# Altium schematic sheet StairLed.SchDoc
size D
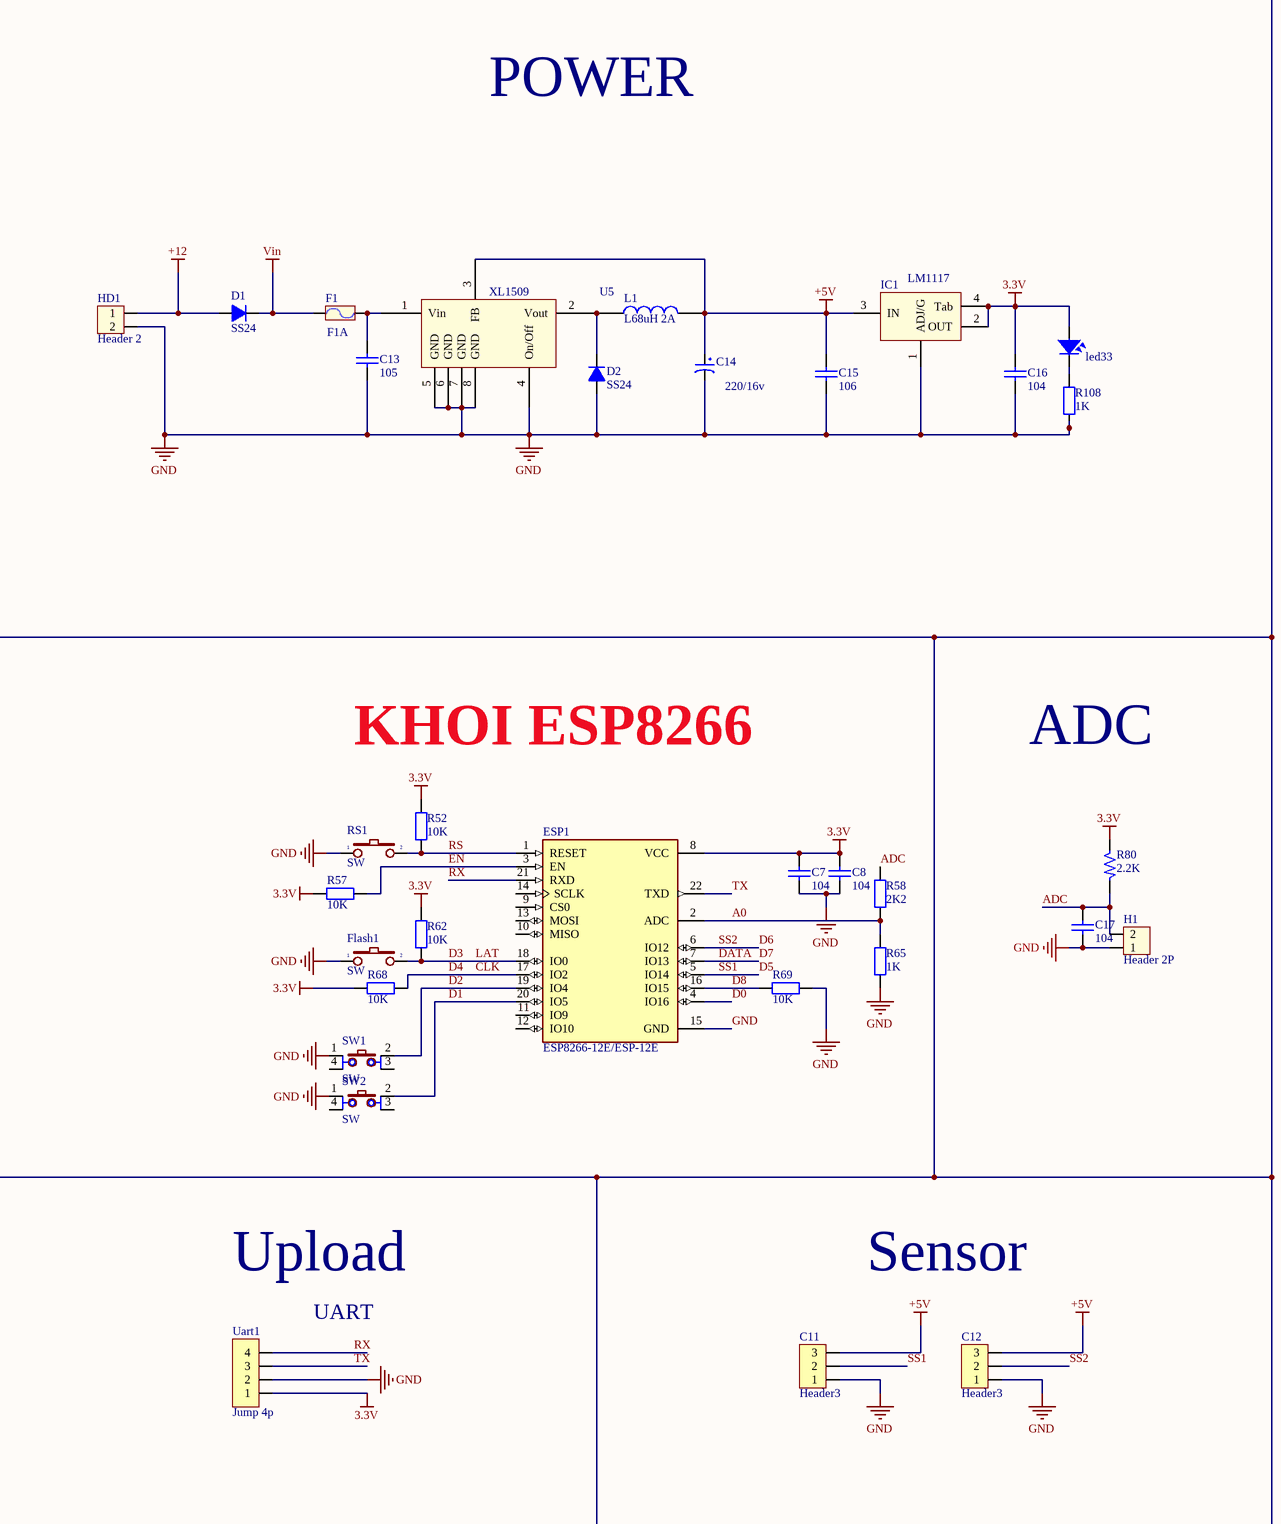
[diagram p0: StairLed.SchDoc, left]
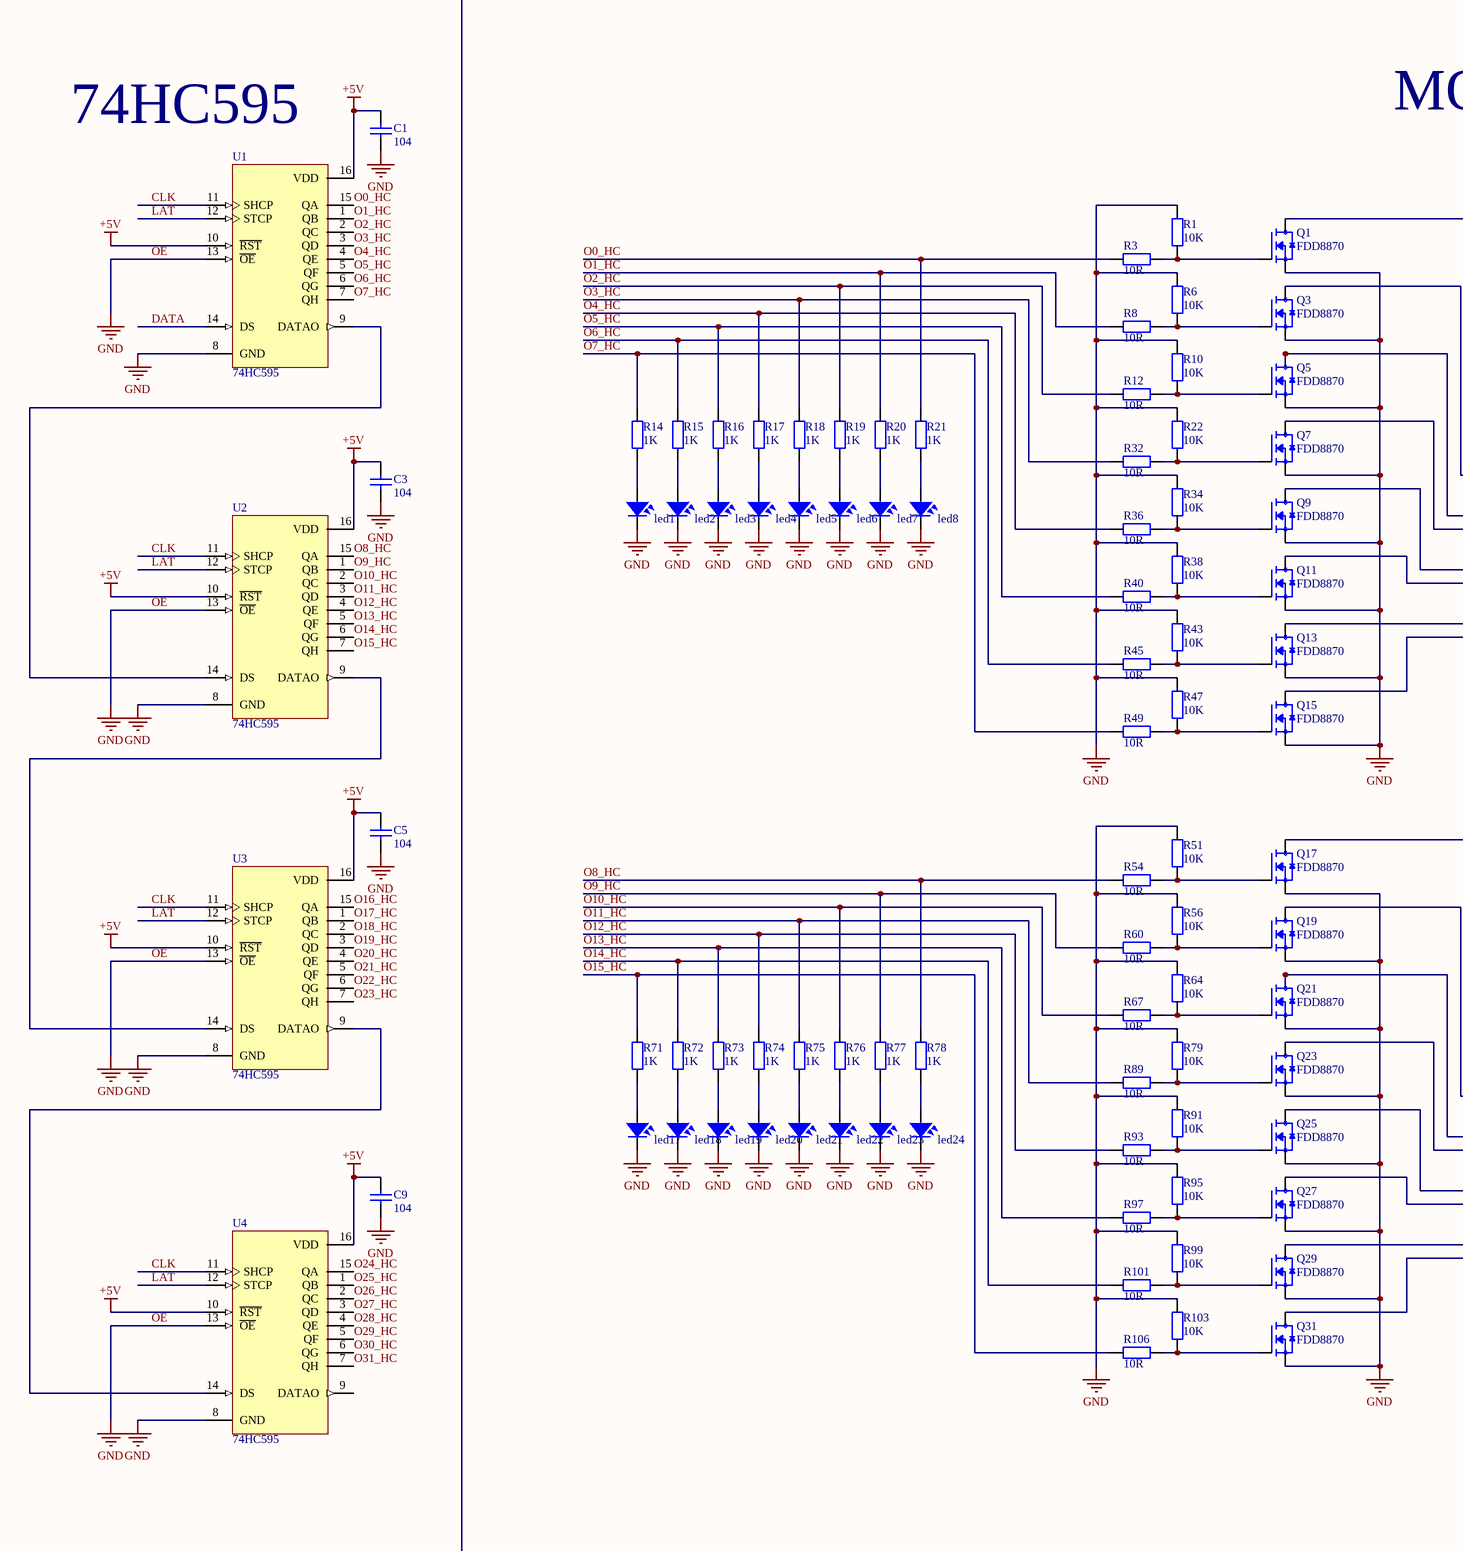
[diagram p1: StairLed.SchDoc, middle]
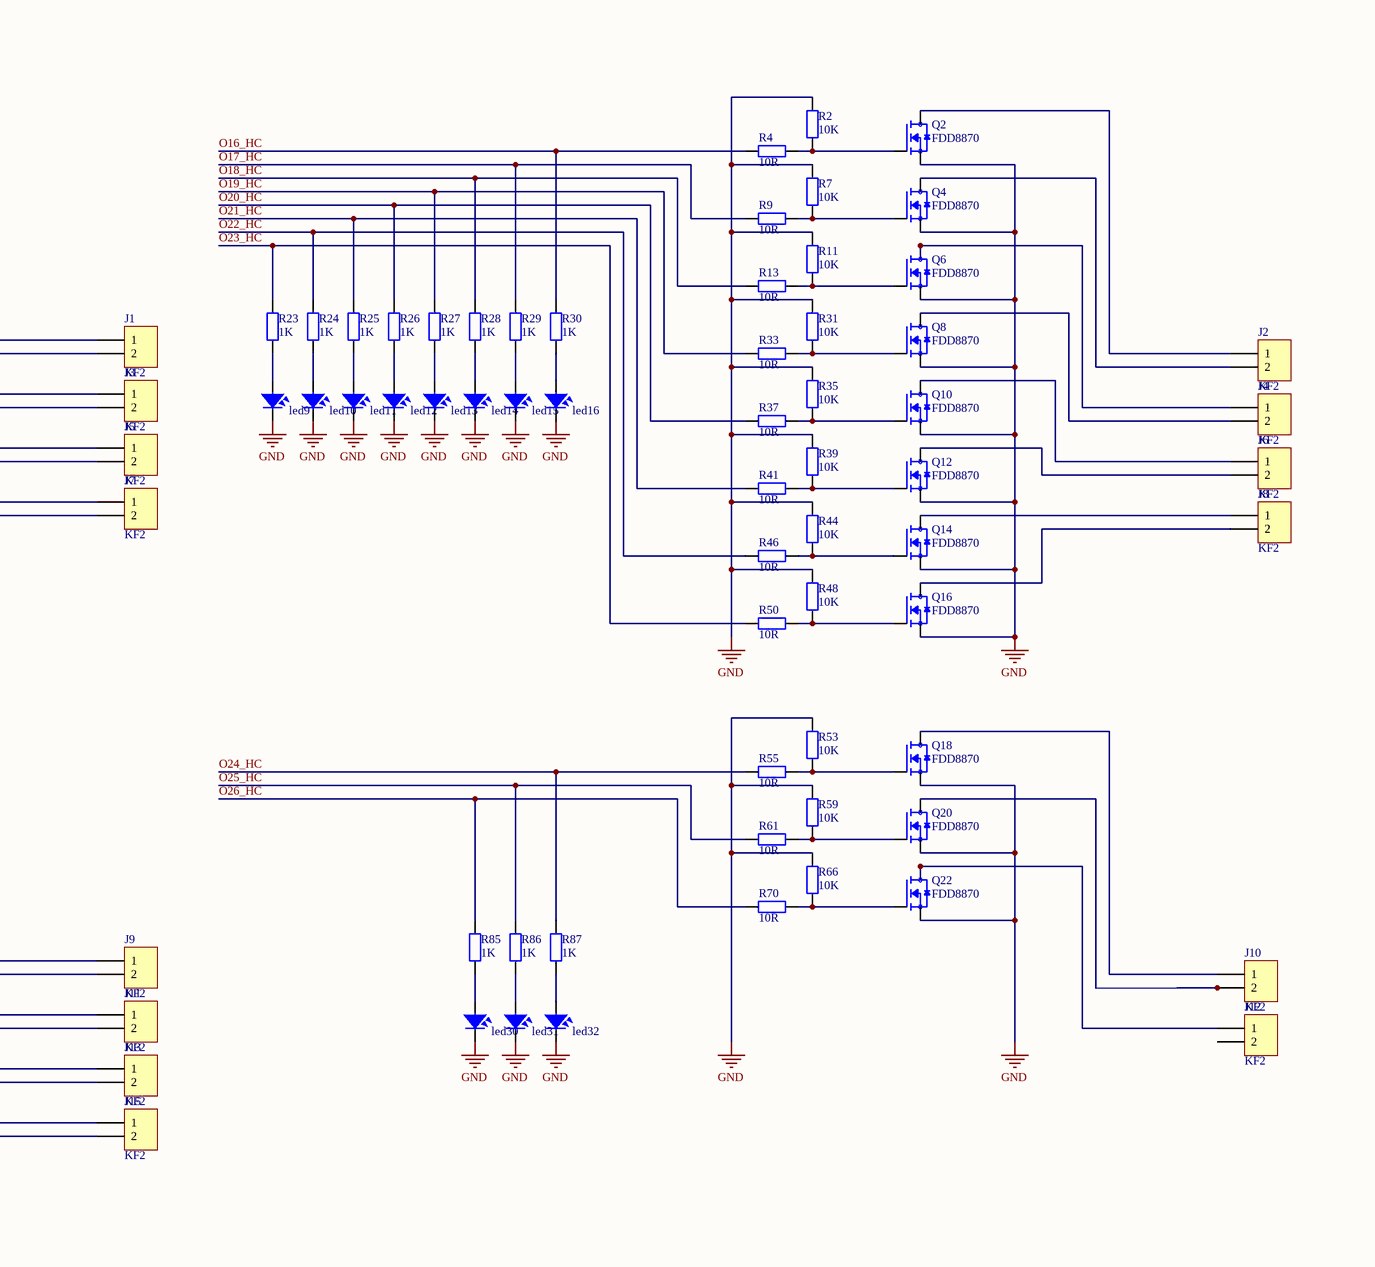
[diagram p2: StairLed.SchDoc, right]

## Parts
C1  104  [Cap-0805]
C3  104  [Cap-0805]
C5  104  [Cap-0805]
C7  104  [Cap-0805]
C8  104  [Cap-0805]
C9  104  [Cap-0805]
C11  Header3  [Header3]
C12  Header3  [Header3]
C13  105  [Cap-0805]
C14  220/16v  [CAP-ALU-SMD-6.3x7.7x2.2]
C15  106  [Cap-0805]
C16  104  [Cap-0805]
C17  104  [Cap-0805]
D1  SS24  [DO-214AC-Zenner]
D2  SS24  [DO-214AC-Zenner]
ESP1  ESP8266-12E/ESP-12E  [XCVR_ESP8266-12E/ESP-12E]
F1  F1A  [1812]
Flash1  SW  [SW1-SMD]
H1  Header 2P  [Header 2P-T]
HD1  Header 2  [HED2]
IC1  LM1117  [SOT223-4N]
J1  KF2  [KF2-3.5]
J2  KF2  [KF2-3.5]
J3  KF2  [KF2-3.5]
J4  KF2  [KF2-3.5]
J5  KF2  [KF2-3.5]
J6  KF2  [KF2-3.5]
J7  KF2  [KF2-3.5]
J8  KF2  [KF2-3.5]
J9  KF2  [KF2-3.5]
J10  KF2  [KF2-3.5]
J11  KF2  [KF2-3.5]
J12  KF2  [KF2-3.5]
J13  KF2  [KF2-3.5]
J15  KF2  [KF2-3.5]
L1  L68uH 2A  [5D28]
led1  LED SMD  [SM-LED-0805-Blue]  (value not drawn)
led2  LED SMD  [SM-LED-0805-Blue]  (value not drawn)
led3  LED SMD  [SM-LED-0805-Blue]  (value not drawn)
led4  LED SMD  [SM-LED-0805-Blue]  (value not drawn)
led5  LED SMD  [SM-LED-0805-Blue]  (value not drawn)
led6  LED SMD  [SM-LED-0805-Blue]  (value not drawn)
led7  LED SMD  [SM-LED-0805-Blue]  (value not drawn)
led8  LED SMD  [SM-LED-0805-Blue]  (value not drawn)
led9  LED SMD  [SM-LED-0805-Blue]  (value not drawn)
led10  LED SMD  [SM-LED-0805-Blue]  (value not drawn)
led11  LED SMD  [SM-LED-0805-Blue]  (value not drawn)
led12  LED SMD  [SM-LED-0805-Blue]  (value not drawn)
led13  LED SMD  [SM-LED-0805-Blue]  (value not drawn)
led14  LED SMD  [SM-LED-0805-Blue]  (value not drawn)
led15  LED SMD  [SM-LED-0805-Blue]  (value not drawn)
led16  LED SMD  [SM-LED-0805-Blue]  (value not drawn)
led17  LED SMD  [SM-LED-0805-Blue]  (value not drawn)
led18  LED SMD  [SM-LED-0805-Blue]  (value not drawn)
led19  LED SMD  [SM-LED-0805-Blue]  (value not drawn)
led20  LED SMD  [SM-LED-0805-Blue]  (value not drawn)
led21  LED SMD  [SM-LED-0805-Blue]  (value not drawn)
led22  LED SMD  [SM-LED-0805-Blue]  (value not drawn)
led23  LED SMD  [SM-LED-0805-Blue]  (value not drawn)
led24  LED SMD  [SM-LED-0805-Blue]  (value not drawn)
led30  LED SMD  [SM-LED-0805-Blue]  (value not drawn)
led31  LED SMD  [SM-LED-0805-Blue]  (value not drawn)
led32  LED SMD  [SM-LED-0805-Blue]  (value not drawn)
led33  LED SMD  [SM-LED-0805-Blue]  (value not drawn)
Q1  FDD8870  [TRANS_SQD50N03-06P-GE3]
Q2  FDD8870  [TRANS_SQD50N03-06P-GE3]
Q3  FDD8870  [TRANS_SQD50N03-06P-GE3]
Q4  FDD8870  [TRANS_SQD50N03-06P-GE3]
Q5  FDD8870  [TRANS_SQD50N03-06P-GE3]
Q6  FDD8870  [TRANS_SQD50N03-06P-GE3]
Q7  FDD8870  [TRANS_SQD50N03-06P-GE3]
Q8  FDD8870  [TRANS_SQD50N03-06P-GE3]
Q9  FDD8870  [TRANS_SQD50N03-06P-GE3]
Q10  FDD8870  [TRANS_SQD50N03-06P-GE3]
Q11  FDD8870  [TRANS_SQD50N03-06P-GE3]
Q12  FDD8870  [TRANS_SQD50N03-06P-GE3]
Q13  FDD8870  [TRANS_SQD50N03-06P-GE3]
Q14  FDD8870  [TRANS_SQD50N03-06P-GE3]
Q15  FDD8870  [TRANS_SQD50N03-06P-GE3]
Q16  FDD8870  [TRANS_SQD50N03-06P-GE3]
Q17  FDD8870  [TRANS_SQD50N03-06P-GE3]
Q18  FDD8870  [TRANS_SQD50N03-06P-GE3]
Q19  FDD8870  [TRANS_SQD50N03-06P-GE3]
Q20  FDD8870  [TRANS_SQD50N03-06P-GE3]
Q21  FDD8870  [TRANS_SQD50N03-06P-GE3]
Q22  FDD8870  [TRANS_SQD50N03-06P-GE3]
Q23  FDD8870  [TRANS_SQD50N03-06P-GE3]
Q25  FDD8870  [TRANS_SQD50N03-06P-GE3]
Q27  FDD8870  [TRANS_SQD50N03-06P-GE3]
Q29  FDD8870  [TRANS_SQD50N03-06P-GE3]
Q31  FDD8870  [TRANS_SQD50N03-06P-GE3]
R1  10K  [R0805]
R2  10K  [R0805]
R3  10R  [R0805]
R4  10R  [R0805]
R6  10K  [R0805]
R7  10K  [R0805]
R8  10R  [R0805]
R9  10R  [R0805]
R10  10K  [R0805]
R11  10K  [R0805]
R12  10R  [R0805]
R13  10R  [R0805]
R14  1K  [R0805]
R15  1K  [R0805]
R16  1K  [R0805]
R17  1K  [R0805]
R18  1K  [R0805]
R19  1K  [R0805]
R20  1K  [R0805]
R21  1K  [R0805]
R22  10K  [R0805]
R23  1K  [R0805]
R24  1K  [R0805]
R25  1K  [R0805]
R26  1K  [R0805]
R27  1K  [R0805]
R28  1K  [R0805]
R29  1K  [R0805]
R30  1K  [R0805]
R31  10K  [R0805]
R32  10R  [R0805]
R33  10R  [R0805]
R34  10K  [R0805]
R35  10K  [R0805]
R36  10R  [R0805]
R37  10R  [R0805]
R38  10K  [R0805]
R39  10K  [R0805]
R40  10R  [R0805]
R41  10R  [R0805]
R43  10K  [R0805]
R44  10K  [R0805]
R45  10R  [R0805]
R46  10R  [R0805]
R47  10K  [R0805]
R48  10K  [R0805]
R49  10R  [R0805]
R50  10R  [R0805]
R51  10K  [R0805]
R52  10K  [R0805]
R53  10K  [R0805]
R54  10R  [R0805]
R55  10R  [R0805]
R56  10K  [R0805]
R57  10K  [R0805]
R58  2K2  [R0805]
R59  10K  [R0805]
R60  10R  [R0805]
R61  10R  [R0805]
R62  10K  [R0805]
R64  10K  [R0805]
R65  1K  [R0805]
R66  10K  [R0805]
R67  10R  [R0805]
R68  10K  [R0805]
R69  10K  [R0805]
R70  10R  [R0805]
R71  1K  [R0805]
R72  1K  [R0805]
R73  1K  [R0805]
R74  1K  [R0805]
R75  1K  [R0805]
R76  1K  [R0805]
R77  1K  [R0805]
R78  1K  [R0805]
R79  10K  [R0805]
R80  2.2K  [Res-0805]
R85  1K  [R0805]
R86  1K  [R0805]
R87  1K  [R0805]
R89  10R  [R0805]
R91  10K  [R0805]
R93  10R  [R0805]
R95  10K  [R0805]
R97  10R  [R0805]
R99  10K  [R0805]
R101  10R  [R0805]
R103  10K  [R0805]
R106  10R  [R0805]
R108  1K  [R0805]
RS1  SW  [SW1-SMD]
SW1  SW  [SW2-DIP]
SW2  SW  [SW2-DIP]
U1  74HC595  [74HC595]
U2  74HC595  [74HC595]
U3  74HC595  [74HC595]
U4  74HC595  [74HC595]
U5  XL1509  [SO8_N]
Uart1  Jump 4p  [Jump 4p]

## Nets
3.3V: C7.2 C8.2 C16.2 ESP1.8(VCC) IC1.2(OUT) IC1.4(Tab) led33.1 R52.2 R57.2 R62.2 R68.2 R80.1 Uart1.1
+5V: C1.1 C3.1 C5.1 C9.1 C11.3 C12.3 C14.1 C15.2 IC1.3(IN) L1.2 U1.10(~{RST}) U1.16(VDD) U2.10(~{RST}) U2.16(VDD) U3.10(~{RST}) U3.16(VDD) U4.10(~{RST}) U4.16(VDD) U5.3(FB)
+12: D1.1(A) HD1.1
GND: C1.2 C3.2 C5.2 C7.1 C8.1 C9.2 C11.1 C12.1 C13.1 C14.2 C15.1 C16.1 C17.2 D2.1(A) ESP1.15(GND) Flash1.1 H1.1 HD1.2 IC1.1(ADJ/G) led1.2 led2.2 led3.2 led4.2 led5.2 led6.2 led7.2 led8.2 led9.2 led10.2 led11.2 led12.2 led13.2 led14.2 led15.2 led16.2 led17.2 led18.2 led19.2 led20.2 led21.2 led22.2 led23.2 led24.2 led30.2 led31.2 led32.2 Q1.3(S) Q2.3(S) Q3.3(S) Q4.3(S) Q5.3(S) Q6.3(S) Q7.3(S) Q8.3(S) Q9.3(S) Q10.3(S) Q11.3(S) Q12.3(S) Q13.3(S) Q14.3(S) Q15.3(S) Q16.3(S) Q17.3(S) Q18.3(S) Q19.3(S) Q20.3(S) Q21.3(S) Q22.3(S) Q23.3(S) Q25.3(S) Q27.3(S) Q29.3(S) Q31.3(S) R1.2 R2.2 R6.2 R7.2 R10.2 R11.2 R22.2 R31.2 R34.2 R35.2 R38.2 R39.2 R43.2 R44.2 R47.2 R48.2 R51.2 R53.2 R56.2 R59.2 R64.2 R65.1 R66.2 R69.1 R79.2 R91.2 R95.2 R99.2 R103.2 R108.2 RS1.1 SW1.1 SW2.1 U1.8(GND) U1.13(~{OE}) U2.8(GND) U2.13(~{OE}) U3.8(GND) U3.13(~{OE}) U4.8(GND) U4.13(~{OE}) U5.4(On/Off) U5.5(GND) U5.6(GND) U5.7(GND) U5.8(GND) Uart1.2  [also labelled OE]
Vin: D1.2(K) F1.2
A0: ESP1.2(ADC) R58.1 R65.2
ADC: C17.1 H1.2 R58.2 R80.2
CLK: ESP1.17(IO2) R68.1 U1.11(SHCP) U2.11(SHCP) U3.11(SHCP) U4.11(SHCP)  [also labelled D4]
D0: ESP1.4(IO16)
D1: ESP1.20(IO5) SW2.2
D2: ESP1.19(IO4) SW1.2
D3: ESP1.18(IO0) Flash1.2 R62.1 U1.12(STCP) U2.12(STCP) U3.12(STCP) U4.12(STCP)  [also labelled LAT]
D5: C11.2 ESP1.5(IO14)  [also labelled SS1]
D6: C12.2 ESP1.6(IO12)  [also labelled SS2]
D7: ESP1.7(IO13) U1.14(DS)  [also labelled DATA]
D8: ESP1.16(IO15) R69.2
EN: ESP1.3(EN) R57.1
O0_HC: R3.2 R21.1 U1.15(QA)
O1_HC: R8.2 R20.1 U1.1(QB)
O2_HC: R12.2 R19.1 U1.2(QC)
O3_HC: R18.1 R32.2 U1.3(QD)
O4_HC: R17.1 R36.2 U1.4(QE)
O5_HC: R16.1 R40.2 U1.5(QF)
O6_HC: R15.1 R45.2 U1.6(QG)
O7_HC: R14.1 R49.2 U1.7(QH)
O8_HC: R54.2 R78.1 U2.15(QA)
O9_HC: R60.2 R77.1 U2.1(QB)
O10_HC: R67.2 R76.1 U2.2(QC)
O11_HC: R75.1 R89.2 U2.3(QD)
O12_HC: R74.1 R93.2 U2.4(QE)
O13_HC: R73.1 R97.2 U2.5(QF)
O14_HC: R72.1 R101.2 U2.6(QG)
O15_HC: R71.1 R106.2 U2.7(QH)
O16_HC: R4.2 R30.1 U3.15(QA)
O17_HC: R9.2 R29.1 U3.1(QB)
O18_HC: R13.2 R28.1 U3.2(QC)
O19_HC: R27.1 R33.2 U3.3(QD)
O20_HC: R26.1 R37.2 U3.4(QE)
O21_HC: R25.1 R41.2 U3.5(QF)
O22_HC: R24.1 R46.2 U3.6(QG)
O23_HC: R23.1 R50.2 U3.7(QH)
O24_HC: R55.2 R87.1 U4.15(QA)
O25_HC: R61.2 R86.1 U4.1(QB)
O26_HC: R70.2 R85.1 U4.2(QC)
O27_HC: U4.3(QD)
O28_HC: U4.4(QE)
O29_HC: U4.5(QF)
O30_HC: U4.6(QG)
O31_HC: U4.7(QH)
RS: ESP1.1(RESET) R52.1 RS1.2
RX: ESP1.21(RXD) Uart1.4
TX: ESP1.22(TXD) Uart1.3
NetC13_2: C13.2 F1.1 U5.1(Vin)
NetD2_2: D2.2(K) L1.1 U5.2(Vout)
NetJ1_1: J1.1 Q1.4(D)
NetJ1_2: J1.2 Q3.4(D)
NetJ2_1: J2.1 Q2.4(D)
NetJ2_2: J2.2 Q4.4(D)
NetJ3_1: J3.1 Q5.4(D)
NetJ3_2: J3.2 Q7.4(D)
NetJ4_1: J4.1 Q6.4(D)
NetJ4_2: J4.2 Q8.4(D)
NetJ5_1: J5.1 Q9.4(D)
NetJ5_2: J5.2 Q11.4(D)
NetJ6_1: J6.1 Q10.4(D)
NetJ6_2: J6.2 Q12.4(D)
NetJ7_1: J7.1 Q13.4(D)
NetJ7_2: J7.2 Q15.4(D)
NetJ8_1: J8.1 Q14.4(D)
NetJ8_2: J8.2 Q16.4(D)
NetJ9_1: J9.1 Q17.4(D)
NetJ9_2: J9.2 Q19.4(D)
NetJ10_1: J10.1 Q18.4(D)
NetJ10_2: J10.2 Q20.4(D)
NetJ11_1: J11.1 Q21.4(D)
NetJ11_2: J11.2 Q23.4(D)
NetJ12_1: J12.1 Q22.4(D)
NetJ13_1: J13.1 Q25.4(D)
NetJ13_2: J13.2 Q27.4(D)
NetJ15_1: J15.1 Q29.4(D)
NetJ15_2: J15.2 Q31.4(D)
Netled1_1: led1.1 R14.2
Netled2_1: led2.1 R15.2
Netled3_1: led3.1 R16.2
Netled4_1: led4.1 R17.2
Netled5_1: led5.1 R18.2
Netled6_1: led6.1 R19.2
Netled7_1: led7.1 R20.2
Netled8_1: led8.1 R21.2
Netled9_1: led9.1 R23.2
Netled10_1: led10.1 R24.2
Netled11_1: led11.1 R25.2
Netled12_1: led12.1 R26.2
Netled13_1: led13.1 R27.2
Netled14_1: led14.1 R28.2
Netled15_1: led15.1 R29.2
Netled16_1: led16.1 R30.2
Netled17_1: led17.1 R71.2
Netled18_1: led18.1 R72.2
Netled19_1: led19.1 R73.2
Netled20_1: led20.1 R74.2
Netled21_1: led21.1 R75.2
Netled22_1: led22.1 R76.2
Netled23_1: led23.1 R77.2
Netled24_1: led24.1 R78.2
Netled30_1: led30.1 R85.2
Netled31_1: led31.1 R86.2
Netled32_1: led32.1 R87.2
Netled33_2: led33.2 R108.1
NetQ1_1: Q1.1(G) R1.1 R3.1
NetQ2_1: Q2.1(G) R2.1 R4.1
NetQ3_1: Q3.1(G) R6.1 R8.1
NetQ4_1: Q4.1(G) R7.1 R9.1
NetQ5_1: Q5.1(G) R10.1 R12.1
NetQ6_1: Q6.1(G) R11.1 R13.1
NetQ7_1: Q7.1(G) R22.1 R32.1
NetQ8_1: Q8.1(G) R31.1 R33.1
NetQ9_1: Q9.1(G) R34.1 R36.1
NetQ10_1: Q10.1(G) R35.1 R37.1
NetQ11_1: Q11.1(G) R38.1 R40.1
NetQ12_1: Q12.1(G) R39.1 R41.1
NetQ13_1: Q13.1(G) R43.1 R45.1
NetQ14_1: Q14.1(G) R44.1 R46.1
NetQ15_1: Q15.1(G) R47.1 R49.1
NetQ16_1: Q16.1(G) R48.1 R50.1
NetQ17_1: Q17.1(G) R51.1 R54.1
NetQ18_1: Q18.1(G) R53.1 R55.1
NetQ19_1: Q19.1(G) R56.1 R60.1
NetQ20_1: Q20.1(G) R59.1 R61.1
NetQ21_1: Q21.1(G) R64.1 R67.1
NetQ22_1: Q22.1(G) R66.1 R70.1
NetQ23_1: Q23.1(G) R79.1 R89.1
NetQ25_1: Q25.1(G) R91.1 R93.1
NetQ27_1: Q27.1(G) R95.1 R97.1
NetQ29_1: Q29.1(G) R99.1 R101.1
NetQ31_1: Q31.1(G) R103.1 R106.1
NetU1_9: U1.9(DATAO) U2.14(DS)
NetU2_9: U2.9(DATAO) U3.14(DS)
NetU3_9: U3.9(DATAO) U4.14(DS)

Not connected (* = marked no-connect by the designer): ESP1 9(CS0) 10(MISO) 11(IO9) 12(IO10) 13(MOSI) 14(SCLK); J12 2; SW1 3 4; SW2 3 4; U4 9(DATAO)

## Notes on the sheet
- POWER
- (near U1) 74HC595
- MOSFET
- KHOI ESP8266
- ADC
- Upload
- UART
- Sensor

## Library data of the parts
C1 C3 C5 C9 C17 = Cap-0805
C7 C8 C13 C15 C16 = Cap: Capacitor; Value: 22 pF; Ðon Giá: 200; Published: 8-Jun-2000; LatestRevisionDate: 17-Jul-2002; LatestRevisionNote: Re-released for DXP Platform.; PackageReference: RAD-0.3; Publisher: Altium Limited
C11 C12 = Header3: Header IDC, 3 x 1 Pin Vertical 2.54mm Pitch (Non-Boxed, Male); Manufacturer: W¨¹rth Elektronik eiSos GmbH; partNo: 613002143121; ComponentLink1 Description: Manufacturer; ComponentLink2 Description: Datasheet; NoPins: 02; Created Date: 29 March 2013; ComponentLink1URL: http://www.we-online.com; ComponentLink2URL: http://katalog.we-online.de/em/datasheet/6130xx143121.pdf; Created by: Karrer Zheng
C14 = CP4: T? Nhôm 330uF 50V 10x10.5MM; Description 5: 4,7uF>10uF/250V_3,3uF>10uF/400V - 2,2uF>4,7uF/450V; Description 1: 2200uF-3300uF/6,3V - 1000uF-2200uF/10V; Description 2: 1000uF/16V - 470uF => 1000uF/25V - 100uF/100V; Description 3: 330uF>470uF/35V_220uF>470uF/50V_10uF>22uF/250V; Description 4: 220uF => 330uF/63V - 10uF =>33uF/160 - 200V; Value: 1000uF/16V; Ðon Giá: 4000
D1 D2 = D1A: Diode 1A; Value: 1N4007
ESP1 = ESP8266-12E/ESP-12E: This WiFi module has a 32-bit MCU micro and clock speeds supporting 80 MHz or 160 MHz. Supports the RTOS and integrated Wi-Fi MAC/BB/RF/PA/LNA, and has an on-board antenna.; MF: AI-Thinker; Price: None; Package: None; Value: *; MP: ESP8266-12E/ESP-12E; Availability: Unavailable; SnapEDA_Link: https://www.snapeda.com/parts/ESP8266-12E/ESP-12E/AI-Thinker/view-part/106414/?ref=snap
F1 = Fuse: C?u chì t? ph?c h?i 1812 0.5A 30V MSMD050-30V; Value: Fuse; Designed by: VanDungEvn; Ðon GIá: 3500
Flash1 RS1 = SW2: Switch button 2 pin; Value: SW chip 2 pin
HD1 = Header 2: Header 2 (Green); Value: Header 2
IC1 = LM1117: AMS1117-3.3V SOT223; Value: LM317; Ðon Giá: 2500
J1-J13 J15 = KF2: Manufacturer: Würth Elektronik eiSos GmbH; partNo: 691103110002; ComponentLink1 Description: Manufacturer; ComponentLink2 Description: Datasheet; NoPins: 2; Created Date: 29 October 2013; ComponentLink1URL: http://www.we-online.com; ComponentLink2URL: http://katalog.we-online.de/em/datasheet/6911031100xx.pdf; Created by: Karrer Zheng
L1 = INDUCTOR: Cu?n c?m dán CD74 68uH 7.4x7.4x4mm; Ðon Giá: 1500
led1-led24 led30-led33 = LED-SMD-0805
Q1-Q23 Q25 Q27 Q29 Q31 = SQD50N03-06P-GE3: Value: *; Availability: Unavailable; Price: None; Package: None; MP: SQD50N03-06P-GE3
R1-R4 R6-R41 R43-R51 R53-R56 R58-R61 R64-R67 R70-R79 R85-R87 R89 R91 R93 R95 R97 R99 R101 R103 R106 R108 = RES_08: Tr? 0805 1%; Value: 0805; Ðon Giá: 80; Published: 8-Jun-2000; LatestRevisionDate: 17-Jul-2002; LatestRevisionNote: Re-released for DXP Platform.; PackageReference: AXIAL-0.4; Publisher: Altium Limited
R52 R57 R62 R68 R69 = RES_08: Value: 0805; Published: 8-Jun-2000; LatestRevisionDate: 17-Jul-2002; LatestRevisionNote: Re-released for DXP Platform.; PackageReference: AXIAL-0.4; Publisher: Altium Limited
R80 = Res-0805
SW1 SW2 = SW4: Switch button 4 pin; Value: Button chip 4 pin
U5 = XL1509: XL1509-5.0 SOP8 DC-DC 2A 5V